# Altium schematic sheet inertial.SchDoc
size A4
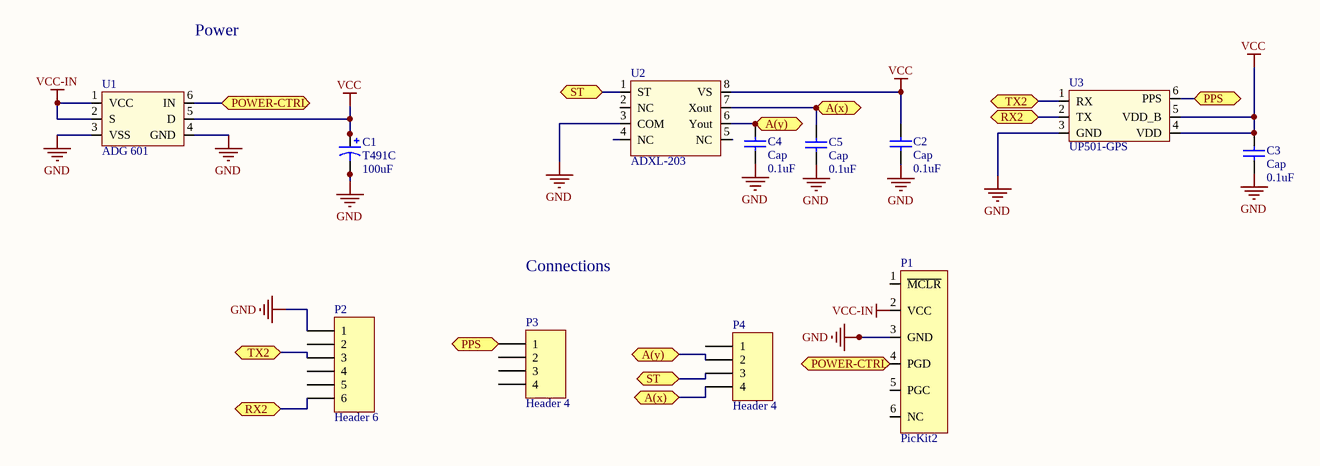
[diagram p0: inertial.SchDoc]

## Parts
C1  T491C  value 100uF  [C]
C2  Cap  value 0.1uF  [C1206]
C3  Cap  value 0.1uF  [C1206]
C4  Cap  value 0.1uF  [C1206]
C5  Cap  value 0.1uF  [C1206]
P1  PicKit2  [PICKIT3]
P2  Header 6  [HDR1X6]
P3  Header 4  [HDR1X4]
P4  Header 4  [HDR1X4]
U1  ADG 601  [SOT26A-6N]
U2  ADXL-203  [ADXL-203]
U3  UP501-GPS  [UP501-GPS]

## Ports
A(x), A(y), POWER-CTRL (bidir), PPS, RX2 (bidir), ST, TX2 (bidir)

## Nets
GND: C1.2 C2.2 C3.2 C4.2 C5.2 P1.3(GND) P2.1 U1.3(VSS) U1.4(GND) U2.3(COM) U3.3(GND)
VCC: C1.1 C2.1 C3.1 U1.5(D) U2.8(VS) U3.4(VDD) U3.5(VDD_B)
VCC-IN: P1.2(VCC) U1.1(VCC) U1.2(S)
A(x): C5.1 P4.4 U2.7(Xout) ; port A(x)
A(y): C4.1 P4.2 U2.6(Yout) ; port A(y)
POWER-CTRL: P1.4(PGD) U1.6(IN) ; port POWER-CTRL
PPS: P3.1 U3.6(PPS) ; port PPS
RX2: P2.6 U3.2(TX) ; port RX2
ST: P4.3 U2.1(ST) ; port ST
TX2: P2.3 U3.1(RX) ; port TX2

Not connected (* = marked no-connect by the designer): P1 1(~{MCLR}) 5(PGC) 6(NC); P2 2 4 5; P3 2 3 4; P4 1; U2 2(NC) 4(NC) 5(NC)

## Notes on the sheet
- Power
- Connections

## Library data of the parts
C1 = T491C: Solid Tantalum Chip Capacitor, Standard T491 Series - Industrial Grade; Published: 17-Jul-2002; LatestRevisionDate: 19-Mar-2004; LatestRevisionNote: Silkscreen dimensions re-sized.; DatasheetDocument: Mar-2001; PackageDocument: Mar-2001; PackageReference: C; Publisher: Altium Limited; Code_JEITA: 6032-28; ComponentLink1Description: Manufacturer Link; ComponentLink1URL: http://www.kemet.com/; ComponentLink2Description: Datasheet; ComponentLink2URL: http://www.kemet.com/kemet/web/homepage/kechome.nsf/vapubfilesname/F3102TA.pdf/$file/F3102TA.pdf
C2-C5 = Cap: Capacitor; Published: 8-Jun-2000; LatestRevisionDate: 17-Jul-2002; LatestRevisionNote: Re-released for DXP Platform.; PackageReference: RAD-0.3; Publisher: Altium Limited; PackageDescription: Radial Cap, Thru-Hole; 2 Leads; 0.3 in Pin Spacing
P2 = Header 6: Header, 6-Pin; LatestRevisionDate: 17-Jul-2002; LatestRevisionNote: Re-released for DXP Platform.; Publisher: Altium Limited
P3 P4 = Header 4: Header, 4-Pin; LatestRevisionDate: 17-Jul-2002; LatestRevisionNote: Re-released for DXP Platform.; Publisher: Altium Limited